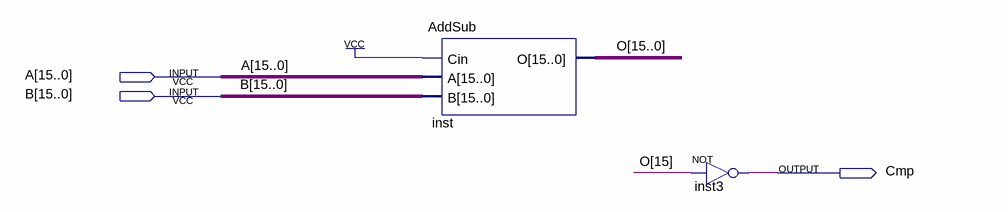
[diagram p0: schematic sheet]
// Quartus schematic Cmp_16b.bdf as structural Verilog: 2 symbols, 3 pins
module Cmp_16b (
  input  [15:0] A,
  input  [15:0] B,
  output Cmp
);

  wire [15:0] O;

  AddSub inst (.Cin(1'b1), .A(A), .B(B), .O(O));
  not inst3 (Cmp, O[15]);
endmodule
